# EAGLE design ATtiny43U_Study_50x31 (EAGLE 7.2.0)
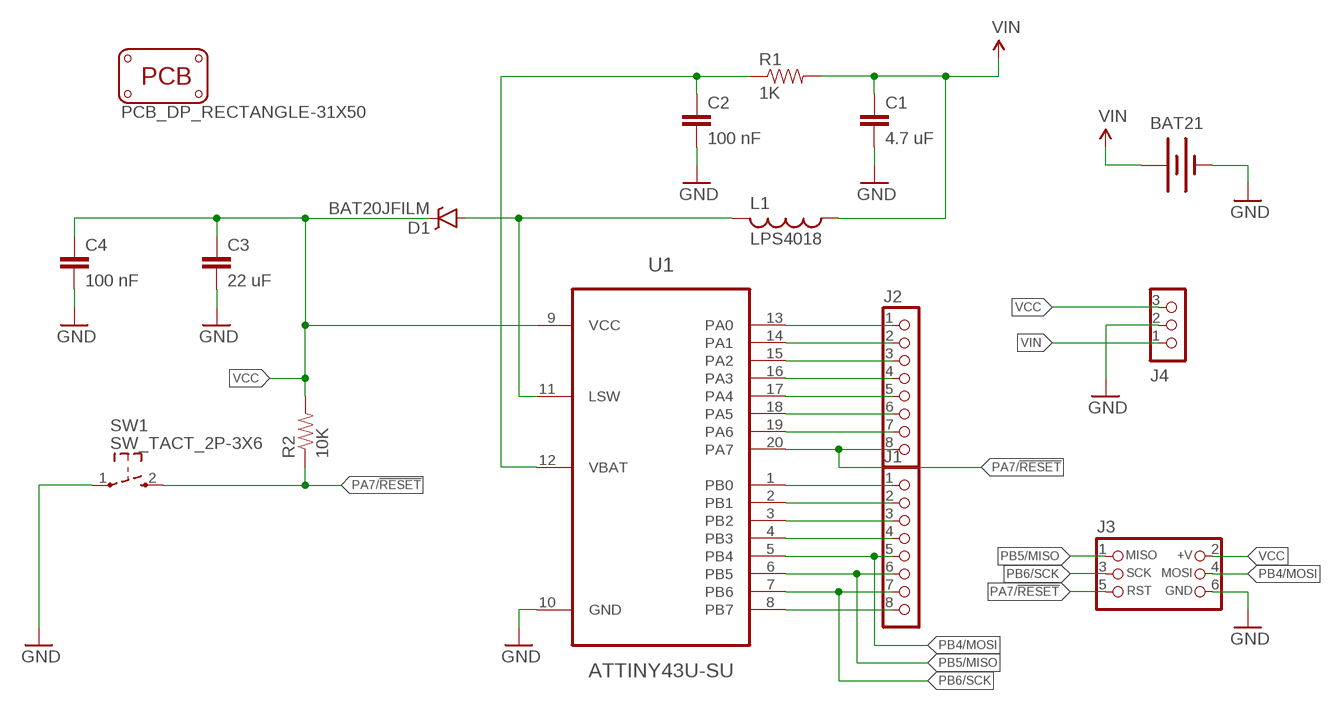
[diagram p0: schematic, sheet 1]

## Parts
BAT21  BATTERYAAA  [BATTERY-AAA]
C1  4.7 uF  CAP0805  [0805]
C2  100 nF  CAP0603-CAP  [0603-CAP]
C3  22 uF  CAP0805  [0805]
C4  100 nF  CAP0603-CAP  [0603-CAP]
D1  BAT20JFILM  [SOD-323]
J1  CON_HEADER_1X08-PTH  [M1X8]
J2  CON_HEADER_1X08-PTH  [M1X8]
J3  CON_HEADER_PRG_AVR_ICSP-PTH  [HEADER_PRG_2X03]
J4  CON_HEADER_1X03-PTH  [M1X3]
L1  LPS4018  [LPS4018]
PCB2  PCB_DP_RECTANGLE-31X50  [DP5031_V1]
R1  1K  1KOHM-1/10W-1%(0603)  [0603-RES]
R2  10K  1KOHM-1/10W-1%(0603)  [0603-RES]
SW1  SW_TACT_2P-3X6  [SW_TACT_3X6]
U1  ATTINY43U-SU  [20S2]

## Nets
GND: BAT21.GND@1(-) C1.2 C2.2 C3.2 C4.2 J3.6(GND) J4.2 SW1.1 U1.10(GND)
LSW: D1.A L1.P$2 U1.11(LSW)
PA0: J2.1 U1.13(PA0)
PA1: J2.2 U1.14(PA1)
PA2: J2.3 U1.15(PA2)
PA3: J2.4 U1.16(PA3)
PA4: J2.5 U1.17(PA4)
PA5: J2.6 U1.18(PA5)
PA6: J2.7 U1.19(PA6)
PA7/!RESET: J2.8 J3.5(RST) R2.1 SW1.2 U1.20(PA7)
PB0: J1.1 U1.1(PB0)
PB1: J1.2 U1.2(PB1)
PB2: J1.3 U1.3(PB2)
PB3: J1.4 U1.4(PB3)
PB4/MOSI: J1.5 J3.4(MOSI) U1.5(PB4)
PB5/MISO: J1.6 J3.1(MISO) U1.6(PB5)
PB6/SCK: J1.7 J3.3(SCK) U1.7(PB6)
PB7: J1.8 U1.8(PB7)
VBAT: C2.1 R1.1 U1.12(VBAT)
VCC: C3.1 C4.1 D1.C J3.2(+V) J4.3 R2.2 U1.9(VCC)
VIN: BAT21.PWR@1(+) C1.1 J4.1 L1.P$1 R1.2

## Library data of the parts
BAT21 = SparkFun-Electromechanical:BATTERY: Battery Holders Various common sizes : AA, AAA, 18650 (PRT-12895), 20mm coin cell and 12mm coin cell. 20MM_4LEGS, BATT-10373; PROD_ID: BATT-08571
C1 = SparkFun-Capacitors:CAP: Capacitor Standard 0603 ceramic capacitor, and 0.1" leaded capacitor.; PARTNO: GRM219R60J475KE19
C2 C4 = SparkFun-Capacitors:CAP: Capacitor Standard 0603 ceramic capacitor, and 0.1" leaded capacitor.
C3 = SparkFun-Capacitors:CAP: Capacitor Standard 0603 ceramic capacitor, and 0.1" leaded capacitor.; PARTNO: GRM21BR60J226ME39
D1 = SparkFun-DiscreteSemi:BAT20JFILM: 23V, 1A Schottky diode, SOD-323 package; PARTNO: PMEG2005EJ; PROD_ID: DIO-11623
J1 J2 = dp_devices.v6:CON_HEADER_1X08
J3 = dp_devices.v6:CON_HEADER_PRG_AVR_ICSP: 2x3 AVR ICSP programming header
J4 = dp_devices.v6:CON_HEADER_1X03
L1 = coilcraft:LPS4018; PARTNO: LPS4018-153MRB
PCB2 = dp_pcb:PCB_DP_RECTANGLE: Dangerous Prototypes Standard Rectangular PCB sizes
R1 = SparkFun-Resistors:1KOHM-1/10W-1%(0603): RES-07856; PROD_ID: RES-07856
R2 = SparkFun-Resistors:1KOHM-1/10W-1%(0603): RES-07856; PROD_ID: RES-07856; VALUE: 1K
SW1 = dp_devices.v6:SW_TACT_2P
U1 = Atmel_AVR8:ATTINY43U

## Board
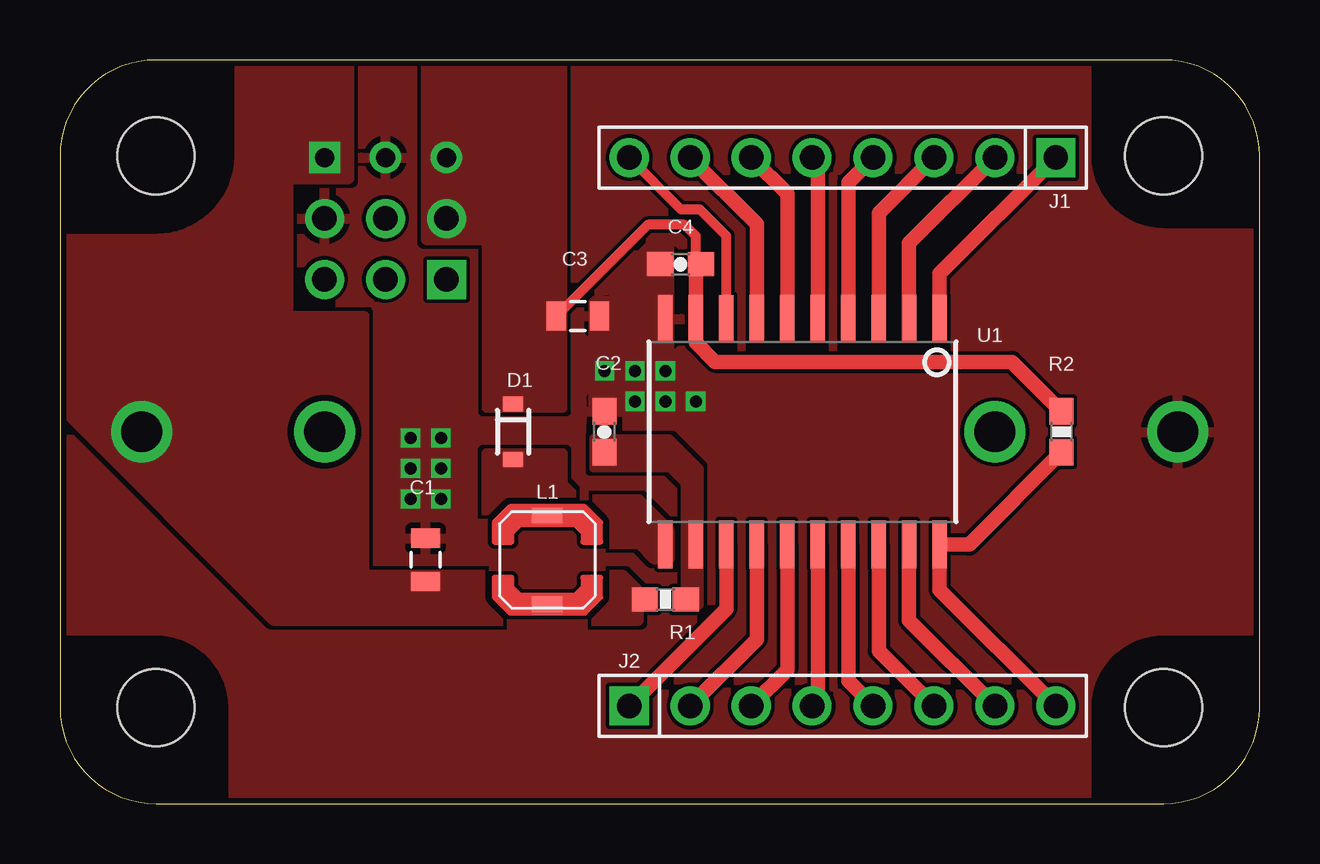
[diagram p1: board, top side]
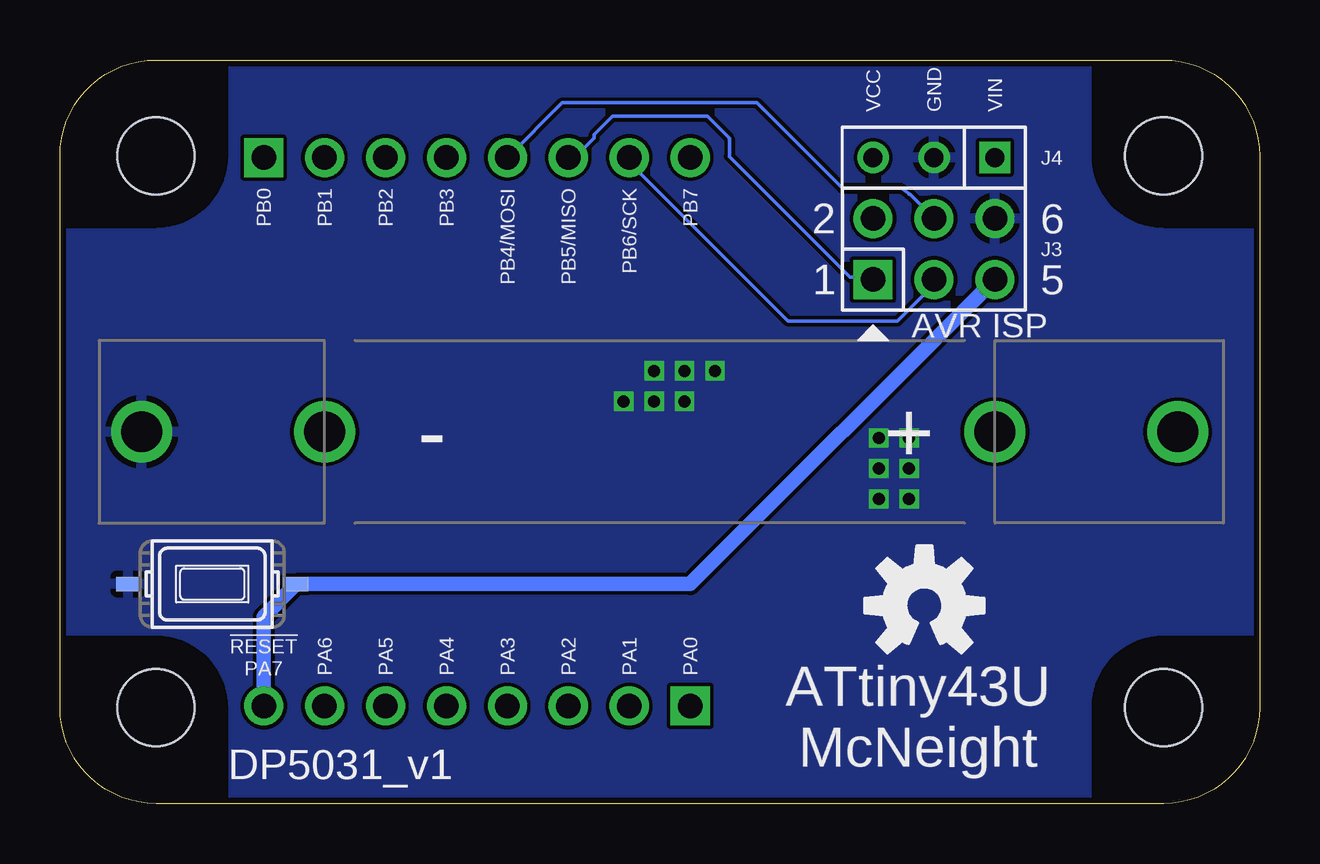
[diagram p2: board, bottom side, seen from below]

Size 50 x 31 mm. Coordinates in mm from the lower left corner, seen from the top.
Copper layers (1*16): Top 0.035mm / dielectric 1.5mm / Bottom 0.035mm
Design rules "SeeedStudio_2layer_DRU_no_angle_20140221": minimum track width 6mil, minimum drill 12mil, track to track 6mil, track to pad 6mil, pad to pad 6mil, via to via 6mil, smd to smd 0mil, copper to edge 10mil, drill to drill 10mil, minimum pad ring 10mil, minimum via ring 6mil, stop-mask expansion 2mil, vias tented up to drill 100mil, thermal gap 10mil

### Footprints (pad centres in the part's own frame; a part is rotated, then mirrored left to right if it is on the bottom)
BATTERY-AAA = drill 1.702: GND@1 21.59,0; GND@2 13.97,0; PWR@1 -21.59,0; PWR@2 -13.97,0
0805 = smd 0.8 x 1.2: 1 -0.9,0; 2 0.9,0
0603-CAP = smd 1.1 x 1: 1 -0.85,0; 2 0.85,0
SOD-323 = smd 0.63 x 0.83: A 1.15,0; C -1.15,0
M1X8 = drill 1.02 pad 1.632 square: 1 -8.89,0 | drill 1.02 pad 1.632: 2 -6.35,0; 3 -3.81,0; 4 -1.27,0; 5 1.27,0; 6 3.81,0; 7 6.35,0; 8 8.89,0
HEADER_PRG_2X03 = drill 1.02 pad 1.632 square: 1 -2.54,-1.27 | drill 1.02 pad 1.632: 2 -2.54,1.27; 3 0,-1.27; 4 0,1.27; 5 2.54,-1.27; 6 2.54,1.27
M1X3 = drill 0.8 square: 1 0,0 | drill 0.8: 2 2.54,0; 3 5.08,0
LPS4018 = smd 0.635 x 1.27: P$1 -1.85,0; P$2 1.85,0
DP5031_V1 = hole 3.2: 4,4; 46,4; 46,27; 4,27
0603-RES = smd 1.1 x 1: 1 -0.85,0; 2 0.85,0
SW_TACT_3X6 = smd 1 x 0.6: 1 -3.5,0; 2 3.5,0
20S2 = smd 2 x 0.6: 1 -4.7,5.715; 2 -4.7,4.445; 3 -4.7,3.175; 4 -4.7,1.905; 5 -4.7,0.635; 6 -4.7,-0.635; 7 -4.7,-1.905; 8 -4.7,-3.175; 9 -4.7,-4.445; 10 -4.7,-5.715; 11 4.7,-5.715; 12 4.7,-4.445; 13 4.7,-3.175; 14 4.7,-1.905; 15 4.7,-0.635; 16 4.7,0.635; 17 4.7,1.905; 18 4.7,3.175; 19 4.7,4.445; 20 4.7,5.715

### Placement (x,y rotation side)
BAT21  25,15.5 180 bottom
C1  15.24,10.16 90 top
C2  22.7,15.5 90 top
C3  21.59,20.32 0 top
C4  25.87,22.48 180 top
D1  18.89,15.5 270 top
J1  32.62,26.93 180 top
J2  32.62,4.07 0 top
J3  13.57,23.12 0 bottom
J4  11.03,26.93 180 bottom
L1  20.32,10.16 90 top
PCB2  0,0 0 top
R1  25.23,8.52 180 top
R2  41.74,15.5 90 top
SW1  43.65,9.15 0 bottom
U1  30.95,15.5 270 top
U$1  [OSHW-LOGO-M]  13.97,8.26 0 bottom

### Tracks (layer width: path | path; a pad name or v marks a point on that pad's centre or on a via)
GND  (via drill 0.5)
  other vias: 14.61,12.7 15.88,12.7 15.88,13.97 14.61,13.97 14.61,15.24 15.88,15.24 23.96,18.04 25.23,18.04 22.7,18.04 26.5,16.77 25.23,16.77 23.96,16.77
  pour Top (rank 2): 0,0 50.8,0 50.8,31.11 0,31.11
  pour Top (isolate 0.254, no thermals): 25.4,18.41 25.4,23.5 24.13,23.5 24.13,20.95 22.23,20.95 22.23,16.51 26.67,16.51 26.67,17.14
  pour Bottom: 0,0 50.16,0 50.16,31.11 0,31.11
  pour Top: 14.61,10.79 15.88,10.79 15.88,15.88 14.61,15.88
LSW
  pour Top (isolate 0.254, no thermals): 17.78,14.61 20.95,14.61 20.95,13.34 21.59,12.7 24.13,12.7 25.4,11.43 25.4,10.16 24.77,10.16 24.13,10.79 17.78,10.79
PA0
  Top 0.61: U1.13 27.77,8.12 J2.1
PA1
  Top 0.61: U1.14 29.05,6.84 J2.2
PA2
  Top 0.61: U1.15 30.32,5.58 J2.3
PA3
  Top 0.61: U1.16 31.59,4.3 J2.4
PA4
  Top 0.61: U1.17 32.85,5.11 J2.5
PA5
  Top 0.61: U1.18 34.12,6.38 J2.6
PA6
  Top 0.61: U1.19 35.4,7.64 J2.7
PA7/!RESET
  Top 0.61: J2.8 36.66,8.91 U1.20 37.9,10.8 R2.1
  Bottom 0.61: J2.8 41.51,7.79 SW1.2 23.73,9.15 J3.5
PB0
  Top 0.61: U1.1 36.66,22.09 J1.1
PB1
  Top 0.61: U1.2 35.4,23.36 J1.2
PB2
  Top 0.61: U1.3 34.12,24.62 J1.3
PB3
  Top 0.61: U1.4 32.85,25.89 J1.4
PB4/MOSI
  Top 0.61: U1.5 31.59,26.7 J1.5
  Bottom 0.152: J1.5 29.07,29.21 20.95,29.21 17.39,25.65 14.94,25.65 14.63,25.45 14.58,25.4 | J3.4 14.58,25.4 | 14.58,25.4 14.61,25.4
PB5/MISO
  Top 0.61: U1.6 30.32,25.43 J1.6
  Bottom 0.152: J3.1 16.15,21.95 17.07,21.95 22.1,26.98 22.1,27.74 23.01,28.65 26.98,28.65 27.74,27.89 27.74,27.74 28.5,26.98 28.8,26.98 J1.6
PB6/SCK
  Top 0.61: U1.7 29.05,24.16 J1.7
  Bottom 0.152: J3.3 13.72,21.79 13.72,21.49 15.09,20.12 19.66,20.12 26.36,26.82 J1.7
PB7
  Top 0.406: U1.8 27.77,23.66 26.67,24.77 25.89,24.77 J1.8
VBAT
  pour Top (no thermals): 26.67,13.97 25.4,15.24 22.23,15.24 22.23,13.97 25.4,13.97 26.04,13.34 26.04,8.26 26.67,8.26
VCC
  Top 0.406: U1.9 26.5,23.66 26.04,24.13 24.5,24.13 C3.1
  Top 0.61: R2.2 39.68,18.41 27.3,18.41 26.5,19.21 U1.9 26.5,22.27 C4.1
  pour Top (isolate 0.254, no thermals): 17.78,16.51 20.95,16.51 20.95,31.11 15.24,31.11 15.24,23.5 17.78,23.5
VIN
  pour Top (isolate 0.254, no thermals): 12.7,9.53 12.7,20.32 9.53,20.32 9.53,26.04 12.06,26.04 12.06,31.11 0,31.11 0,16.51 8.89,7.62 24.13,7.62 24.13,8.89 23.5,9.53

### Text on the board
tNames: L1
bNames: VIN | GND | VCC | PB7 | PB6/SCK | PB5/MISO | PB4/MOSI | PB3 | PB2 | PB1 | PB0 | AVR ISP | PA0 | PA1 | PA2 | PA3 | PA4 | PA5 | PA6 | !RESET / PA7 | ATtiny43U | McNeight